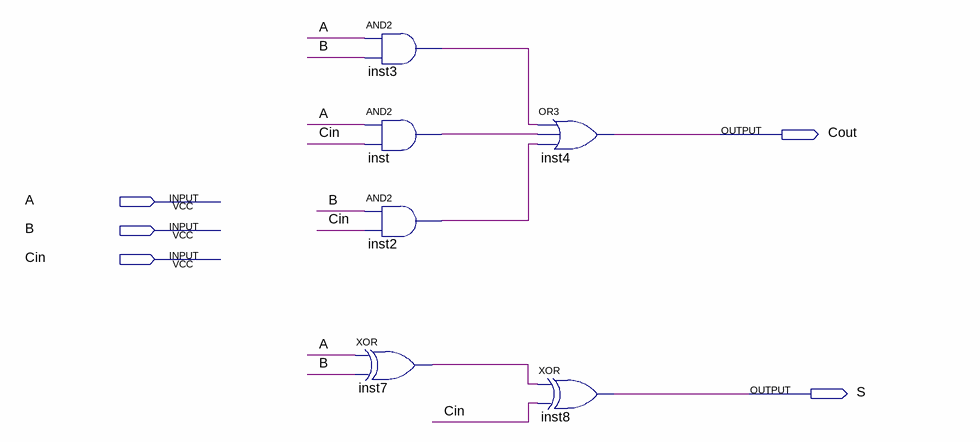
[diagram p0: schematic sheet]
// Quartus schematic FullAdder.bdf as structural Verilog: 6 symbols, 5 pins
module FullAdder (
  input  A,
  input  B,
  input  Cin,
  output Cout,
  output S
);

  wire inst2_out, inst3_out, inst7_out, inst_out;

  and inst3 (inst3_out, A, B);
  and inst (inst_out, A, Cin);
  and inst2 (inst2_out, B, Cin);
  xor inst7 (inst7_out, A, B);
  or inst4 (Cout, inst3_out, inst_out, inst2_out);
  xor inst8 (S, inst7_out, Cin);
endmodule
